# Altium project MB1272.PrjPcb (part 2 of 2)

## Sheet MB1272-Project.SchDoc: MB1272
size A4; Date: Not used; ApprovedBy: Not used; CheckedBy: Not used; Author: Not used; CompanyName: STMicroelectronics; DrawnBy: Not used; Engineer: Not used; Organization: Not used; Address1: Not used; Address2: Not used; Address3: Not used; Address4: Not used; DocumentNumber: Not used; Revision: Not used; SheetNumber: 1; SheetTotal: 15; CurrentTime: Not used; CurrentDate: Not used; Time: Not used; DocumentFullPathAndName: Not used; DocumentName: Not used; ModifiedDate: Not used; ImagePath: Not used; ProjectName: STM32MP15x-DISCO-PI; Application_BuildNumber: Not used
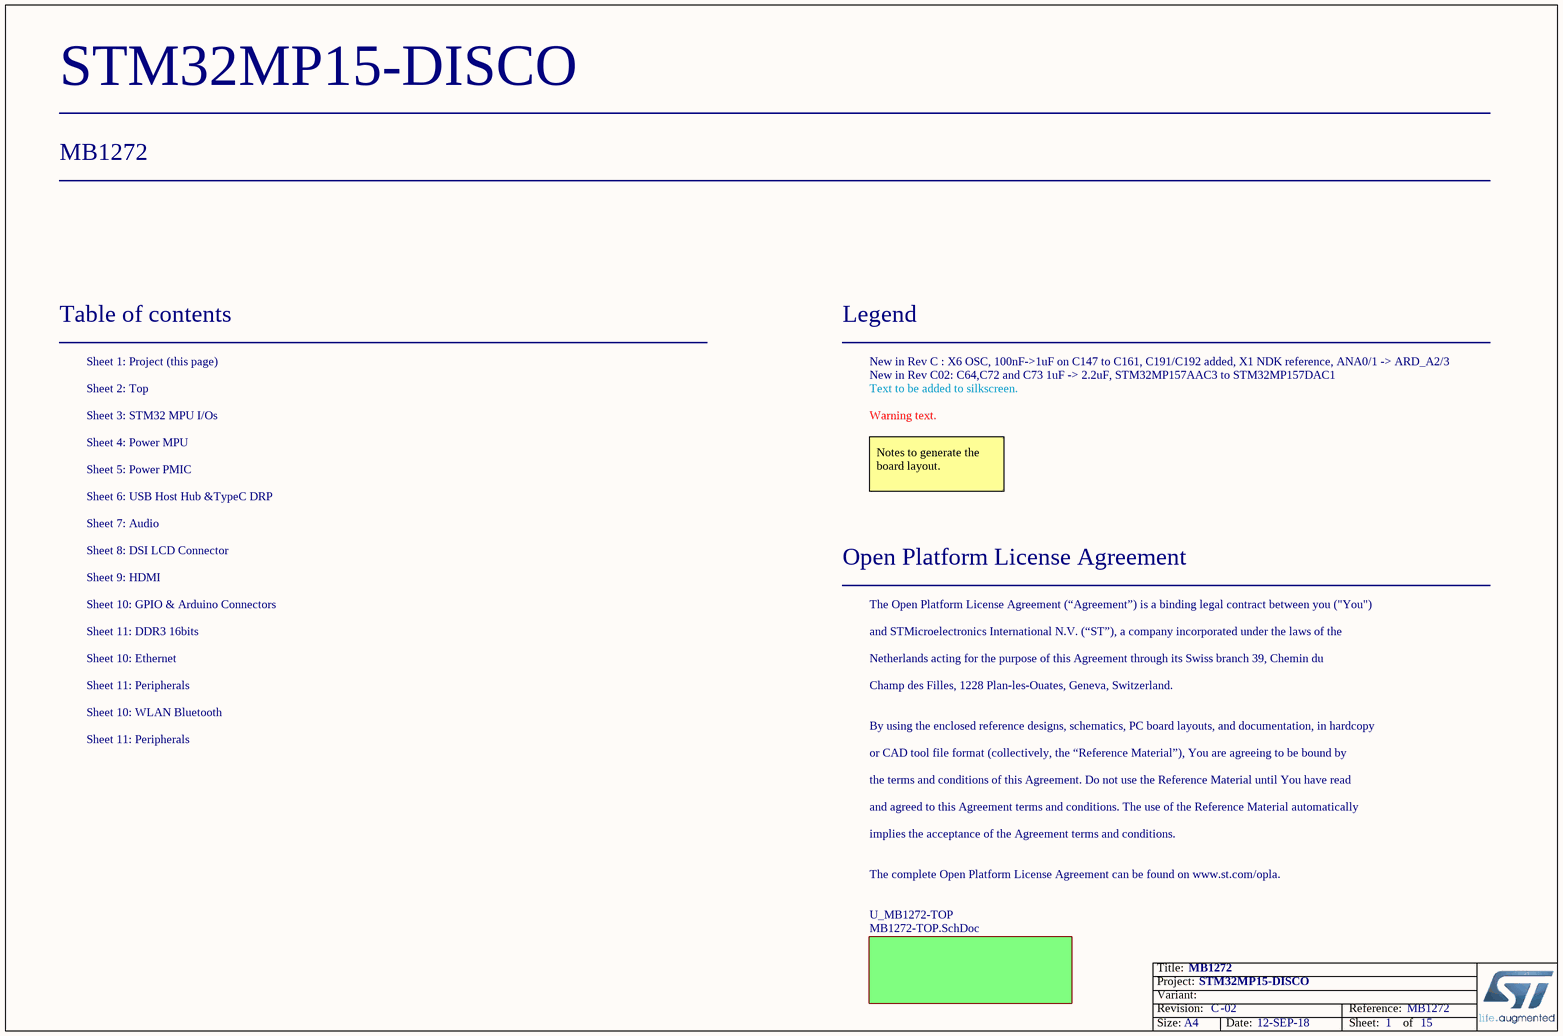
[diagram p3: MB1272-Project.SchDoc]

### Sub-sheets
U_MB1272-TOP = MB1272-TOP.SchDoc (file not in this document): no entries

### Notes on the sheet
- Table of contents
- Sheet 1: Project (this page)
- Legend
- New in Rev C : X6 OSC, 100nF->1uF on C147 to C161, C191/C192 added, X1 NDK reference, ANA0/1 -> ARD_A2/3
- New in Rev C02: C64,C72 and C73 1uF -> 2.2uF, STM32MP157AAC3 to STM32MP157DAC1
- Sheet 2: Top
- Sheet 3: STM32 MPU I/Os
- Sheet 4: Power MPU
- Text to be added to silkscreen.
- Warning text.
- Sheet 6: USB Host Hub &TypeC DRP
- Sheet 5: Power PMIC
- Notes to generate the board layout.
- Sheet 7: Audio
- Sheet 9: HDMI
- Sheet 8: DSI LCD Connector
- Open Platform License Agreement
- Sheet 10: GPIO & Arduino Connectors
- Sheet 11: DDR3 16bits
- The Open Platform License Agreement (“Agreement”) is a binding legal contract between you ("You")
- and STMicroelectronics International N.V. (“ST”), a company incorporated under the laws of the
- Sheet 10: Ethernet
- Sheet 11: Peripherals
- Sheet 10: WLAN Bluetooth
- Netherlands acting for the purpose of this Agreement through its Swiss branch 39, Chemin du
- Champ des Filles, 1228 Plan-les-Ouates, Geneva, Switzerland.
- By using the enclosed reference designs, schematics, PC board layouts, and documentation, in hardcopy
- or CAD tool file format (collectively, the “Reference Material”), You are agreeing to be bound by
- the terms and conditions of this Agreement. Do not use the Reference Material until You have read
- and agreed to this Agreement terms and conditions. The use of the Reference Material automatically
- implies the acceptance of the Agreement terms and conditions.
- The complete Open Platform License Agreement can be found on www.st.com/opla.
- Title:
- Project:
- Size:
- Revision:
- Variant:
- A4
- -
- Date:
- Reference:
- Sheet:
- of

## Nets that join several sheets
3V3: MPU_12x12 (6 pins), Power_PMIC (5 pins)
GND: MPU_12x12 (15 pins), Power_MPU (85 pins), Power_PMIC (51 pins)
VDD: MPU_12x12 (5 pins), Power_MPU (16 pins), Power_PMIC (C44.2 L6.2 U4.31 U4.42)
VDD_CORE: Power_MPU (28 pins), Power_PMIC (LNK2.2 R3.2)
VDD_DDR: Power_MPU (14 pins), Power_PMIC (5 pins)
VDD_USB: Power_MPU (C139.2 U13.AA15 U13.AA17), Power_PMIC (C16.2 U4.39)
VDDA: Power_MPU (R78.1), Power_PMIC (C32.2 U4.20)
VREF_DDR: MPU_12x12 (C68.2 U13.AC20), Power_PMIC (C15.2 U4.16)
I2C4_SCL: MPU_12x12 (R5.2 U13.G2), Power_PMIC (U4.4)
I2C4_SDA: MPU_12x12 (R7.2 U13.H2), Power_PMIC (U4.3)
NRST: MPU_12x12 (U13.M3), Power_PMIC (R6.1)
PA0_WKUP: MPU_12x12 (U13.AB3), Power_PMIC (U4.43)
PMIC_WAKEUP: MPU_12x12 (U13.K2), Power_PMIC (U4.2)
USB_PWR_CC1: MPU_12x12 (U13.V4), Power_PMIC (R49.2)
USB_PWR_CC2: MPU_12x12 (U13.V3), Power_PMIC (R56.2)

## Assembly variants
DK2: not fitted C8 C19 C24 C34 C87 C88 CN12 R9 R12 R32 R69 R73 R74 R78 R127 R134 R140 SB7 SB8 SB11 SB12 SB13 SB14 SB15 SB16 SB18 SB23 SB25
DK1: not fitted C8 C19 C24 C28 C29 C34 C37 C45 C87 C88 CN12 CN18 L1 L4 R9 R12 R17 R20 R22 R26 R27 R32 R69 R73 R74 R78 SB7 SB8 SB11 SB12 SB13 SB14 SB15 SB16 SB18 SB23 SB25 U8